# Altium schematic sheet MC33797.SchDoc: Squibs
size Legal; Project: Olympus; Organization: Stanford SSI; Address1: L3, 12a Rodborough Rd; Address2: Frenchs Forest; Address3: NSW; Address4: Australia 2086; SheetNumber: n; SheetTotal: m
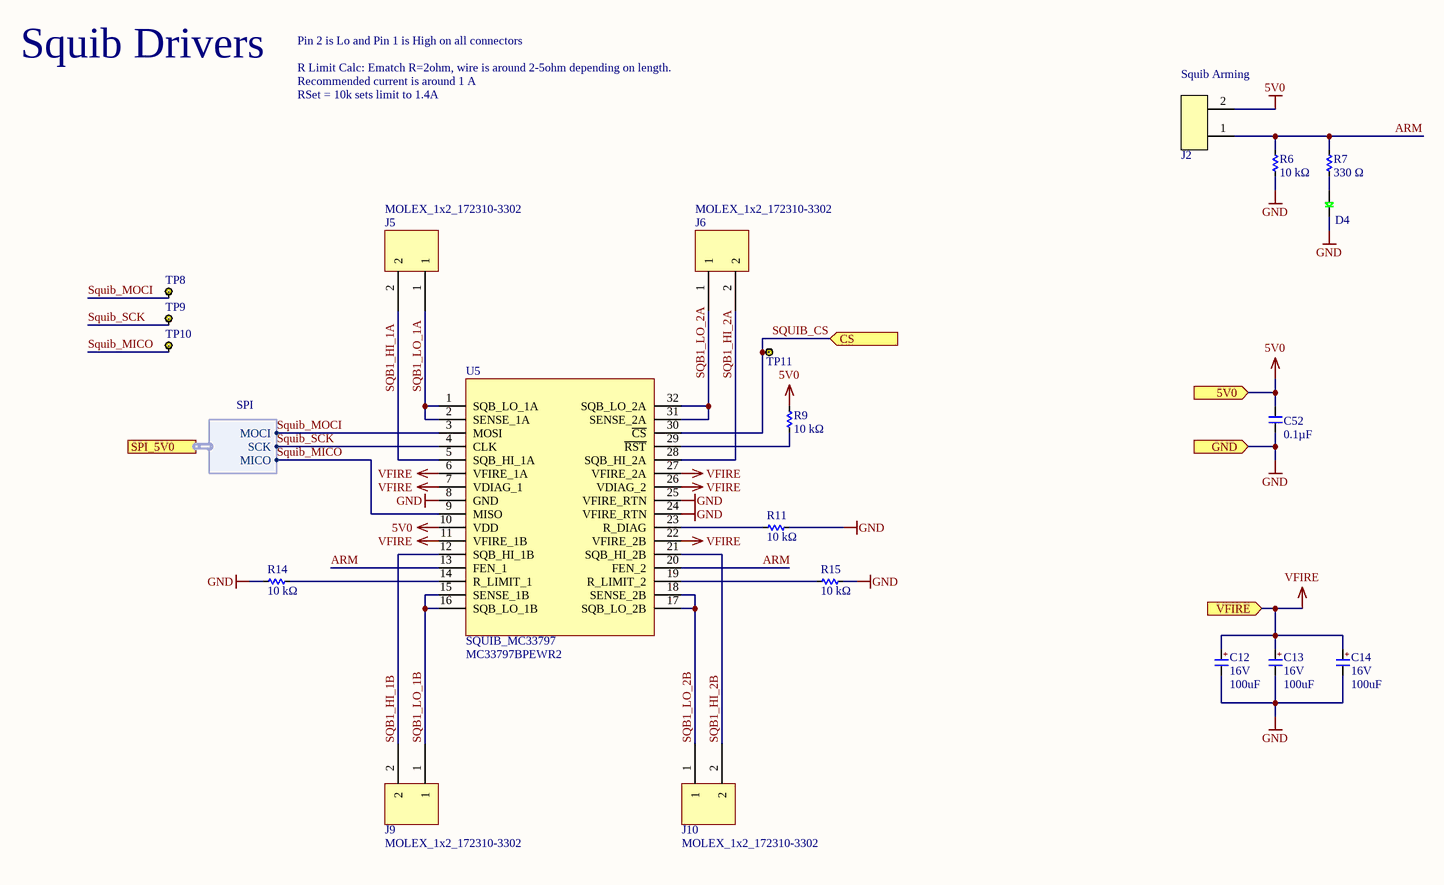
[diagram p0: MC33797.SchDoc]

## Parts
C12  Capacitance: 100uF  Voltage Rating: 16V  [CAPCP6032X28N]  (hidden comment: TPSC107M016R0200)
C13  Capacitance: 100uF  Voltage Rating: 16V  [CAPCP6032X28N]  (hidden comment: TPSC107M016R0200)
C14  Capacitance: 100uF  Voltage Rating: 16V  [CAPCP6032X28N]  (hidden comment: TPSC107M016R0200)
C52  Capacitance (shorthand): 0.1µF  [C0603]  (hidden comment: 490-1519-1-ND)
D4  LED_C503B-GCS-CB0C0781  [LED_TH_5MM]  (value not drawn)
J2  CONN_1x2  [CONN_1x2_100MIL]  (value not drawn)
J5  MOLEX_1x2_172310-3302  [Molex 172310-xx02]
J6  MOLEX_1x2_172310-3302  [Molex 172310-xx02]
J9  MOLEX_1x2_172310-3302  [Molex 172310-xx02]
J10  MOLEX_1x2_172310-3302  [Molex 172310-xx02]
R6  Resistance: 10 kΩ  [R0603]  (hidden comment: 311-10.0KHRCT-ND)
R7  Resistance: 330 Ω  [R0603]  (hidden comment: 311-330HRCT-ND)
R9  Resistance: 10 kΩ  [R0603]  (hidden comment: 311-10.0KHRCT-ND)
R11  Resistance: 10 kΩ  [R0603]  (hidden comment: 311-10.0KHRCT-ND)
R14  Resistance: 10 kΩ  [R0603]  (hidden comment: 311-10.0KHRCT-ND)
R15  Resistance: 10 kΩ  [R0603]  (hidden comment: 311-10.0KHRCT-ND)
TP8  TEST_POINT_BLACK_KEYSTONE_5001  [TEST_POINT_BLACK_KEYSTONE_5001-Footprint-1]  (value not drawn)
TP9  TEST_POINT_BLACK_KEYSTONE_5001  [TEST_POINT_BLACK_KEYSTONE_5001-Footprint-1]  (value not drawn)
TP10  TEST_POINT_BLACK_KEYSTONE_5001  [TEST_POINT_BLACK_KEYSTONE_5001-Footprint-1]  (value not drawn)
TP11  TEST_POINT_BLACK_KEYSTONE_5001  [TEST_POINT_BLACK_KEYSTONE_5001-Footprint-1]  (value not drawn)
U5  SQUIB_MC33797  Manufacturer Part Number: MC33797BPEWR2  [SOT1762-1]

## Ports
5V0 (in), CS (in), GND (in), SPI_5V0 (harness SPI), VFIRE (in)

## Harnesses
SPI: SCK, MOCI, MICO

## Nets
5V0: C52.1 J2.2 R9.2 U5.10(VDD) ; port 5V0
GND: C12.2(K) C13.2(K) C14.2(K) C52.2 D4.2(K) R6.2 R11.2 R14.1 R15.2 U5.8(GND) U5.24(VFIRE_RTN) U5.25(VFIRE_RTN) ; port GND
VFIRE: C12.1(A) C13.1(A) C14.1(A) U5.6(VFIRE_1A) U5.7(VDIAG_1) U5.11(VFIRE_1B) U5.22(VFIRE_2B) U5.26(VDIAG_2) U5.27(VFIRE_2A) ; port VFIRE
ARM: J2.1 R6.1 R7.2 U5.13(FEN_1) U5.20(FEN_2)
SQB1_HI_1A: J5.2 U5.5(SQB_HI_1A)
SQB1_HI_1B: J9.2 U5.12(SQB_HI_1B)
SQB1_HI_2A: J6.2 U5.28(SQB_HI_2A)
SQB1_HI_2B: J10.2 U5.21(SQB_HI_2B)
SQB1_LO_1A: J5.1 U5.1(SQB_LO_1A) U5.2(SENSE_1A)
SQB1_LO_1B: J9.1 U5.15(SENSE_1B) U5.16(SQB_LO_1B)
SQB1_LO_2A: J6.1 U5.31(SENSE_2A) U5.32(SQB_LO_2A)
SQB1_LO_2B: J10.1 U5.17(SQB_LO_2B) U5.18(SENSE_2B)
SQUIB_CS: TP11.1 U5.30(~{CS}) ; port CS
Squib_MICO: TP10.1 U5.9(MISO) ; port SPI_5V0.MICO
Squib_MOCI: TP8.1 U5.3(MOSI) ; port SPI_5V0.MOCI
Squib_SCK: TP9.1 U5.4(CLK) ; port SPI_5V0.SCK
NetD4_1: D4.1(A) R7.1
NetR9_1: R9.1 U5.29(~{RST})
NetR11_1: R11.1 U5.23(R_DIAG)
NetR14_2: R14.2 U5.14(R_LIMIT_1)
NetR15_1: R15.1 U5.19(R_LIMIT_2)

## Notes on the sheet
- Squib Drivers
- R Limit Calc: Ematch R=2ohm, wire is around 2-5ohm depending on length.
- Pin 2 is Lo and Pin 1 is High on all connectors
- Recommended current is around 1 A
- (near J2) Squib Arming
- RSet = 10k sets limit to 1.4A
- PROJECT
- SHEET
- Powered By
- Sheet
- of
- REVISION
- ssi.stanford.edu
- ENGINEER
- REVIEWER
- REVIEWED ON
- (in symbol CMP-066-0014-2) +

## Library data of the parts
C12-C14 = CMP-066-0014-2: Cap Tant Solid 100uF 16V C CASE 20% (6 X 3.2 X 2.6mm) SMD 6032-28 0.2 Ohm 125°C T/R; ESR (Equivalent Series Resistance): 200mR; Polarity: Polar; Dissipation Factor: 6%; Construction: Flat; Tolerance: 20%; Lead Free: Lead Free; Termination: SMD/SMT; Min Operating Temperature: -55°C; Depth: 3.2mm; Case Code (Imperial): 2312; Mount: Surface Mount; Length: 6mm; Series: TPS; Package Quantity: 500; Max Operating Temperature: 125°C; Packaging: Tape and Reel; Radiation Hardening: No; Height: 2.8mm; Height - Seated (Max): 0.11inch; Voltage Rating (DC): 16V; Case/Package: Molded; Features: General Purpose; Width: 3.2mm; Case Code (Metric): 6032; RoHS Compliant: Yes
C52 = CMP-119-0065-1: CAP CER 0603 0.1µF X7R 50V 10%; Manufacturer: Murata Electronics North America; Capacitance - pF (Machine readable): #NAME?; Rated Voltage: 50V; Dielectric: X7R
D4 = CMP-033-0070-3: LED GREEN CLEAR 5MM ROUND T/H; Manufacturer: Cree; Lens Colour: Colorless; Luminous Intensity: 24850mcd; Viewing Angle: 30°; Forward Current: 20mA; Forward Voltage: 3.2V; Lens Style: Dome; Dominant Wavelength: 527nm; Power Rating: 120mW; Reverse Voltage (DC): 5V; Number of LEDs: 1; Manufacturer Part Number: C503B-GCS-CB0C0781; Stock 1: 191; Pricing 1: 1=0.25, 10=0.236, 100=0.2184, 1000=0.1954, 50000=0.1814 (USD); Mount: Through Hole; Case/Package: Radial; Colour: Green; Min Operating Temperature: -40°C; Max Operating Temperature: 95°C; Illumination Colour: Green; Packaging: Bulk; Package Quantity: 500; Lens Transparency: Clear; Test Current: 20mA; Wavelength: 527nm; Length: 5.8mm; Height: 12.7mm; Width: 5mm; ComponentLink1URL: http://www.mouser.com/ds/2/90/cree.C503B%20BAS%20BAN%20BCS%20BCN%20GAS%20GAN%20GCS%20GCN%201094[1]-310350.pdf; ComponentLink1Description: http://www.mouser.com/ds/2/90/cree.C503B%20BAS%20BAN%20BCS%20BCN%20GAS%20GAN%20GCS%20GCN%201094[1]-310350.pdf; ComponentLink2URL: http://www.cree.com/led-components/media/documents/C503B-BAS-BAN-BCS-BCN-GAS-GAN-GCS-GCN-1094.pdf; ComponentLink2Description: http://www.cree.com/led-components/media/documents/C503B-BAS-BAN-BCS-BCN-GAS-GAN-GCS-GCN-1094.pdf; Design Item ID: LED_C503B-GCS-CB0C0781; Source: diode.SchLib
J2 = CMP-029-0001-1: CONN HEADER 2POS VERT T/H; Manufacturer Part Number: 77311-118-02LF; Manufacturer: FCI; Number of Positions: 2; Pitch: 0.100" (2.54mm); Connector Type: Header, Unshrouded; Number of Positions Loaded: All; Features: -; ComponentLink1URL: http://portal.fciconnect.com/res/en/pdffiles/doc_search//77311.pdf; Row Spacing: -; Mounting Type: Through Hole; Contact Finish: Gold, GXT™; RoHS: RoHS Compliant; Termination: Solder; Source: connector.SchLib; Number of Rows: 1; Color: Black; ComponentLink1Description: http://portal.fciconnect.com/res/en/pdffiles/doc_search//77311.pdf; Contact Mating Length: 0.230" (5.84mm); Packaging: Bulk; Design Item ID: CONN_1x2; Fastening Type: -; Contact Type: Male Pin; Contact Finish Thickness: 30µin (0.76µm)
J5 J6 J9 J10 = CMP-025-0004-1: ULTRAFIT CONN HEADER R/A 2POS 3.5MM; Source: connector.SchLib; Design Item ID: MOLEX_1x2_1723101102
R6 R9 R11 R14 R15 = CMP-126-0273-2: RES SMD 10K OHM 1% 1/10W 0603; Manufacturer Part Number: RC0603FR-0710KL; Manufacturer: Yageo; Resistance (Sortable): 10000; Power (Watts): 0.1W, 1/10W; Temperature Coefficient: ±100ppm/°C; Datasheets: http://www.yageo.com/documents/recent/PYu-RC_Group_51_RoHS_L_9.pdf; Image: //media.digikey.com/Renders/Yageo%20Renders/0603-(1608-Metric).jpg; Tolerance: ±1%; Operating Temperature: -55°C ~ 155°C
R7 = CMP-126-0120-2: RES SMD 330 OHM 1% 1/10W 0603; Manufacturer Part Number: RC0603FR-07330RL; Manufacturer: Yageo; Resistance (Sortable): 330; Power (Watts): 0.1W, 1/10W; Temperature Coefficient: ±100ppm/°C; Datasheets: http://www.yageo.com/documents/recent/PYu-RC_Group_51_RoHS_L_9.pdf; Image: //media.digikey.com/Renders/Yageo%20Renders/0603-(1608-Metric).jpg; Tolerance: ±1%; Operating Temperature: -55°C ~ 155°C
TP8-TP11 = CMP-055-0004-2: BLACK T/H TEST POINT; Manufacturer Part Number: 5001; Manufacturer: Keystone Electronics; Material - Body: Phosphor Bronze; Material - Insulation: Nylon 46, UL 94V-0; Plating: Silver; ComponentLink1Description: http://www.keyelco.com/product-pdf.cfm?p=1310; Source: mechanical.SchLib; Part Status: Active; Stock 1: 718799; RoHS: RoHS Compliant; Packaging: Bulk; Mounting Type: 0.040" (1.02mm) Hole Diameter; ComponentLink1URL: http://www.keyelco.com/product-pdf.cfm?p=1310; Pricing 1: 1=0.37, 10=0.316, 50=0.2298, 100=0.2209, 250=0.19832, 500=0.18932, 1000=0.1616, 2500=0.14424, 5000=0.13523 (USD); Size / Dimension: 0.100" Dia x 0.180" L (2.54mm x 4.57mm); Color: Black; Design Item ID: TEST_POINT_BLACK_KEYSTONE_5001
U5 = CMP-045-0005-1: Manufacturer: NXP USA Inc.; Interface: SPI; Voltage - Supply: 4.75 V ~ 5.25 V; RoHS: RoHS Compliant; Packaging: Cut Tape (CT); Part Status: Active; Applications: -; Package / Case: 32-SOIC (0.295", 7.50mm Width); Supplier Device Package: 32-SOIC; Mounting Type: Surface Mount; ComponentLink1URL: http://cache.freescale.com/files/analog/doc/data_sheet/MC33797.pdf; ComponentLink1Description: http://cache.freescale.com/files/analog/doc/data_sheet/MC33797.pdf; Source: ic_interface.SchLib; Design Item ID: SQUIB_MC33797